# Altium schematic sheet R2D.SchDoc: Ready-to-Drive Sound
size A4; CheckedBy: Nico Bieberich; Author: Nico Bieberich; Organization: Baltic Racing; Address1: Zur Schwedenschanze 15; Address2: Haus 18; Address3: 18435 Stralsund; Revision: xx.xx; SheetNumber: 5; SheetTotal: 6; Rules: LVS; ProjectName: Projekt
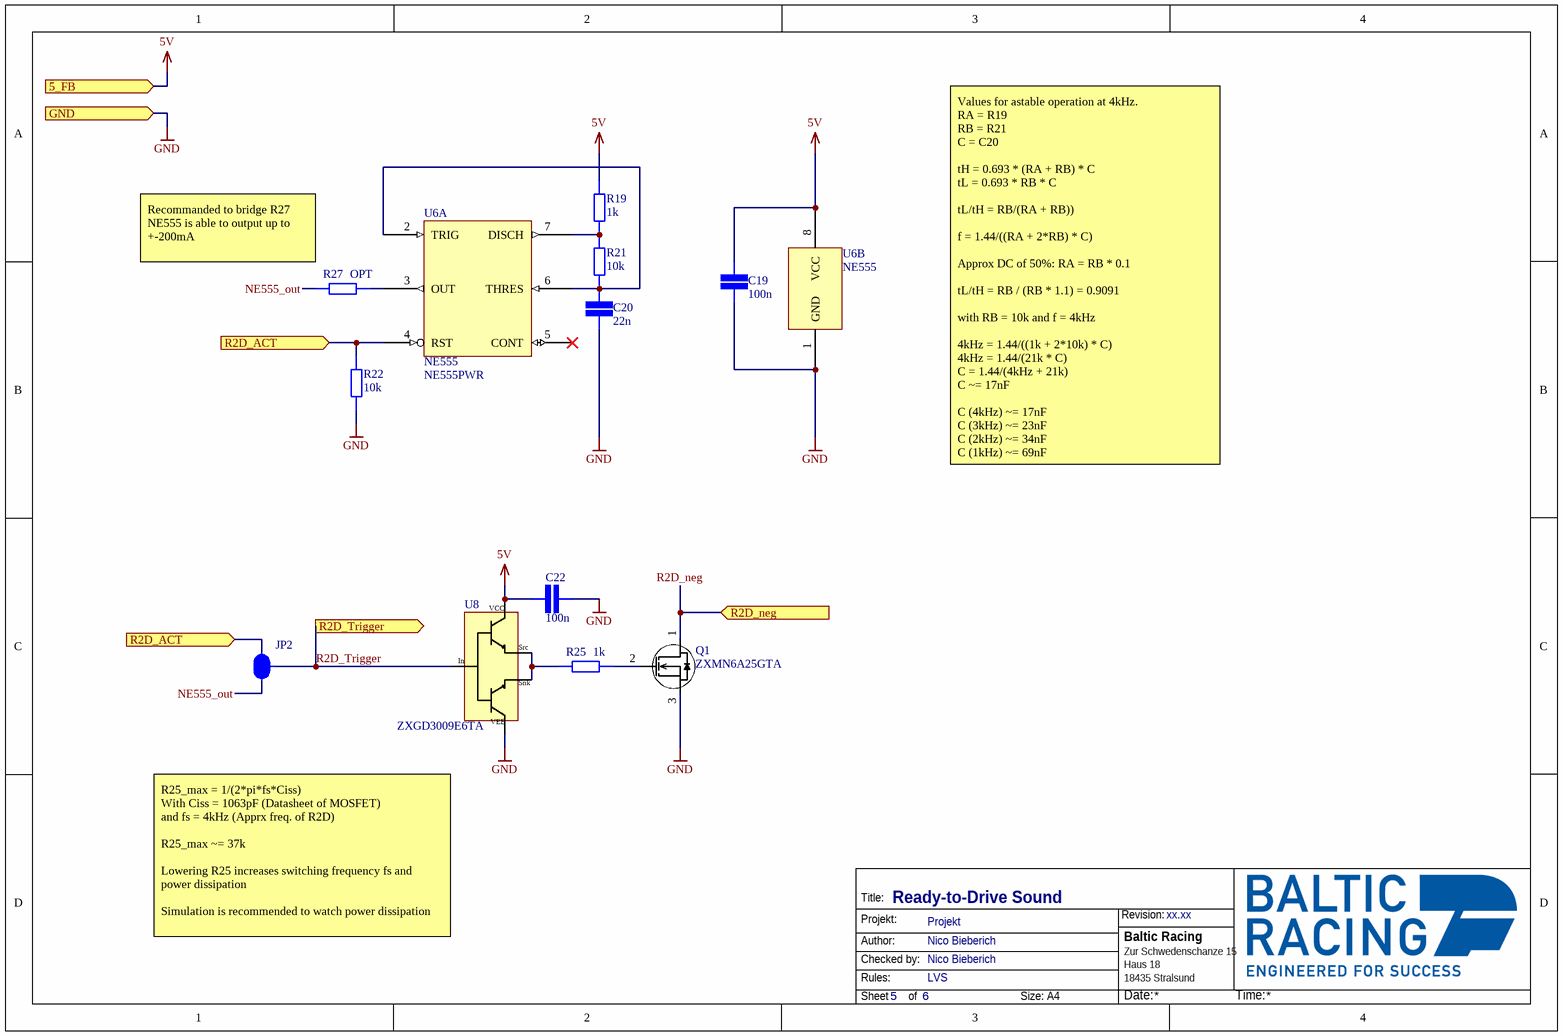
[diagram p0: R2D.SchDoc]

## Parts
C19  value 100n  [CAP 0603/1608]  (hidden comment: SMD Capacitor)
C20  value 22n  [CAP 0603/1608]  (hidden comment: SMD Capacitor)
C22  value 100n  [CAP 0603/1608]  (hidden comment: SMD Capacitor)
JP2  JUMPERID  [SMD-JUMPER-3]  (value not drawn)  (net tie, no BOM)
Q1  ZXMN6A25GTA  [ZXMN6A25GTA]
R19  value 1k  [STACKPOLE CSR0603]  (hidden comment: SMD Resistor)
R21  value 10k  [STACKPOLE CSR0603]  (hidden comment: SMD Resistor)
R22  value 10k  [STACKPOLE CSR0603]  (hidden comment: SMD Resistor)
R25  value 1k  [STACKPOLE CSR0603]  (hidden comment: SMD Resistor)
R27  value OPT  [STACKPOLE CSR0603]  (hidden comment: SMD Resistor)
U6  NE555  value NE555PWR  [NE555PWR]  (parts A,B of 2)
U8  ZXGD3009E6TA  [ZXGD3009E6TA]

## Ports
5_FB (in), GND (in), R2D_ACT (in), R2D_neg (in), R2D_Trigger (out)

## Nets
5V: C19.2 C22.1 R19.2 U6.8(VCC) U8.1(VCC) ; port 5_FB
GND: C19.1 C20.1 C22.2 Q1.3(S) R22.1 U6.1(GND) U8.3(VEE) ; port GND
NE555_out: JP2.3 R27.2
R2D_ACT: JP2.1 R22.2 U6.4(RST) ; port R2D_ACT
R2D_neg: Q1.1(D) ; port R2D_neg
R2D_Trigger: JP2.2 U8.2(In) ; port R2D_Trigger
NetC20_2: C20.2 R21.1 U6.2(TRIG) U6.6(THRES)
NetQ1_2: Q1.2(G) R25.1
NetR19_1: R19.1 R21.2 U6.7(DISCH)
NetR25_2: R25.2 U8.4(Snk) U8.6(Src)
NetR27_1: R27.1 U6.3(OUT)

Not connected (* = marked no-connect by the designer): U6 5(CONT)*

## Notes on the sheet
- (near R27) Recommanded to bridge R27
  NE555 is able to output up to +-200mA
- Values for astable operation at 4kHz.
  RA = R19
  RB = R21
  C = C20
  tH = 0.693 * (RA + RB) * C
  tL = 0.693 * RB * C
  tL/tH = RB/(RA + RB))
  f = 1.44/((RA + 2*RB) * C)
  Approx DC of 50%: RA = RB * 0.1
  tL/tH = RB / (RB * 1.1) = 0.9091
  with RB = 10k and f = 4kHz
  4kHz = 1.44/((1k + 2*10k) * C)
  4kHz = 1.44/(21k * C)
  C = 1.44/(4kHz + 21k)
  C ~= 17nF
  C (4kHz) ~= 17nF
  C (3kHz) ~= 23nF
  C (2kHz) ~= 34nF
  C (1kHz) ~= 69nF
- R25_max = 1/(2*pi*fs*Ciss)
  With Ciss = 1063pF (Datasheet of MOSFET)
  and fs = 4kHz (Apprx freq. of R2D)
  R25_max ~= 37k
  Lowering R25 increases switching frequency fs and power dissipation
  Simulation is recommended to watch power dissipation
- Title:
- Projekt:
- Revision:
- Author:
- Rules:
- Checked by:
- Sheet
- of
- Size:
- A4
- Date:
- Time:

## Library data of the parts
C19 C20 C22 = SMD Capacitor: Capacitor with multiple Footprints; Voltage: 16
JP2 = SMD Jumper 3
Q1 = ZXMN6A25GTA: Diodes Inc. ZXMN6A25GTA / N-Channel MOSFET, 60V, 6.7A; ComponentLink1Description: Octopart; ComponentLink1URL: https://octopart.com/zxmn6a25gta-diodes+inc.-7519510?r=sp
R19 R21 R22 R25 R27 = SMD Resistor: Resistor with multiple footprints; Power: 0.1W
U6 = NE555: Single Precision Timer
U8 = ZXGD3009E6TA: Diodes Inc. ZXGD3009E6TA / MOSFET Gate Driver, 1Ch, 1A; ComponentLink1Description: Octopart; ComponentLink1URL: https://octopart.com/zxgd3009e6ta-diodes+inc.-49477954?r=sp